# Altium schematic sheet PLL_ADF4169.SchDoc
size A3; SheetNumber: 13; SheetTotal: 25
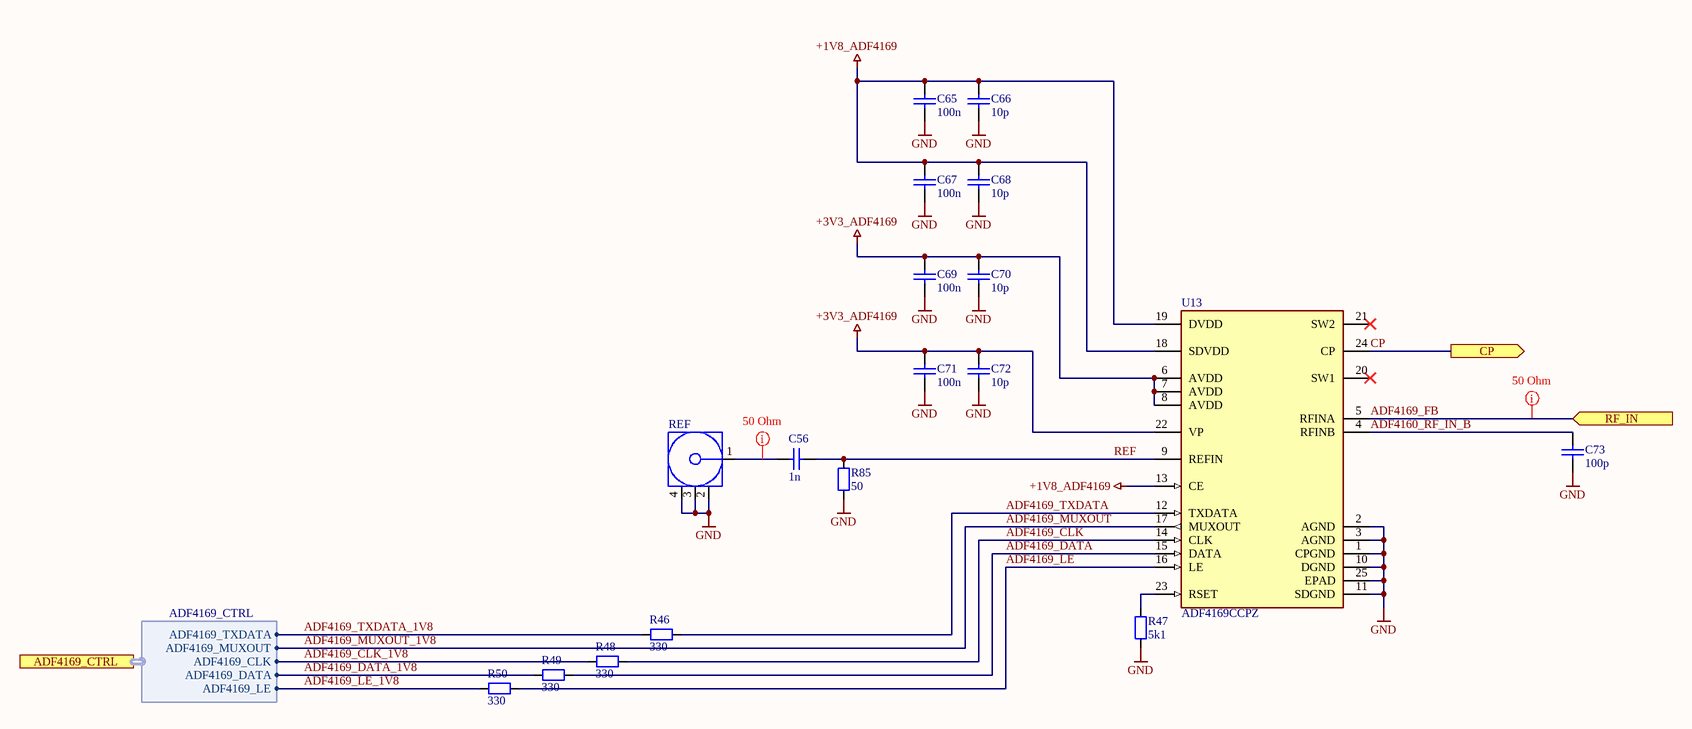
[diagram p0: PLL_ADF4169.SchDoc]

## Parts
C56  1n  [C_0402_1005Metric_IPC_N]
C65  100n  [C_0402_1005Metric_IPC_N]
C66  10p  [C_0402_1005Metric_IPC_N]
C67  100n  [C_0402_1005Metric_IPC_N]
C68  10p  [C_0402_1005Metric_IPC_N]
C69  100n  [C_0402_1005Metric_IPC_N]
C70  10p  [C_0402_1005Metric_IPC_N]
C71  100n  [C_0402_1005Metric_IPC_N]
C72  10p  [C_0402_1005Metric_IPC_N]
C73  100p  [C_0402_1005Metric_IPC_N]
R46  330  [R_0402_1005Metric_IPC_N]
R47  5k1  [R_0402_1005Metric_IPC_N]
R48  330  [R_0402_1005Metric_IPC_N]
R49  330  [R_0402_1005Metric_IPC_N]
R50  330  [R_0402_1005Metric_IPC_N]
R85  50  [R_0402_1005Metric_IPC_N]
REF  60312862112552  [60312862112552]  (value not drawn)
U13  ADF4169CCPZ  [LFCSP-WQ-24-1EP_4x4mm_P0.5mm_EP2.1x2.1mm_IPC_N]

## Ports
ADF4169_CTRL (harness ADF4169_CTRL, see Top_Level[2B], MCU[8A]), CP (out, see Top_Level[2B], Loop_Filter_AD8065[2C]), RF_IN (in, see Top_Level[2B])

## Harnesses
ADF4169_CTRL: ADF4169_MUXOUT, ADF4169_CLK, ADF4169_DATA, ADF4169_LE, ADF4169_TXDATA

## Nets
+1V8_ADF4169: C65.2 C66.2 C67.2 C68.2 U13.13(CE) U13.18(SDVDD) U13.19(DVDD)
+3V3_ADF4169: C69.2 C70.2 C71.2 C72.2 U13.6(AVDD) U13.7(AVDD) U13.8(AVDD) U13.22(VP)
GND: C65.1 C66.1 C67.1 C68.1 C69.1 C70.1 C71.1 C72.1 C73.1 R47.1 R85.1 REF.2(GND) REF.3(GND) REF.4(GND) U13.1(CPGND) U13.2(AGND) U13.3(AGND) U13.10(DGND) U13.11(SDGND) U13.25(EPAD)
ADF4160_RF_IN_B: C73.2 U13.4(RFINB)
ADF4169_CLK: R48.2 U13.14(CLK)
ADF4169_CLK_1V8: R48.1 ; port ADF4169_CTRL.ADF4169_CLK
ADF4169_DATA: R49.2 U13.15(DATA)
ADF4169_DATA_1V8: R49.1 ; port ADF4169_CTRL.ADF4169_DATA
ADF4169_FB: U13.5(RFINA) ; port RF_IN
ADF4169_LE: R50.2 U13.16(LE)
ADF4169_LE_1V8: R50.1 ; port ADF4169_CTRL.ADF4169_LE
ADF4169_MUXOUT: U13.17(MUXOUT) ; port ADF4169_CTRL.ADF4169_MUXOUT  [also labelled ADF4169_MUXOUT_1V8]
ADF4169_TXDATA: R46.2 U13.12(TXDATA)
ADF4169_TXDATA_1V8: R46.1 ; port ADF4169_CTRL.ADF4169_TXDATA
CP: U13.24(CP) ; port CP
REF: C56.1 R85.2 U13.9(REFIN)
NetC56_2: C56.2 REF.1(Signal)
NetR47_2: R47.2 U13.23(RSET)

Not connected (* = marked no-connect by the designer): U13 20(SW1)* 21(SW2)*

## Layout directives
net class 50R: ADF4169_FB
net class 50Ohm_CPWG: NetC56_2

## Library data of the parts
C56 = C000002: Generic MLCC with 0402 Footprint; Specific Component: False; Tolerance: 5%; Temp Coefficient: C0G; Voltage Rated: 50V; ID: C000002; Capacitance: 1n; min Temperature: *; max Temperature: *; Case: 0402; Supplier 1: Mouser; Supplier Part Number 1: 81-GRM1555C1H102JA1D; Supplier 2: Digikey; Supplier Part Number 2: 490-3244-1-ND
C65 C67 C69 C71 = C000002: Generic MLCC with 0402 Footprint; Specific Component: False; Tolerance: 10%; Temp Coefficient: X7R; Voltage Rated: 50V; ID: C000002; Capacitance: 100n; min Temperature: *; max Temperature: *; Case: 0402; Supplier 1: Mouser; Supplier Part Number 1: 81-GRM155R71H104KE4D; Supplier 2: Digikey; Supplier Part Number 2: 490-10700-1-ND
C66 C68 C70 C72 = C000002: Generic MLCC with 0402 Footprint; Specific Component: False; Tolerance: 0.5p; Temp Coefficient: C0G; Voltage Rated: 50V; ID: C000002; Capacitance: 10p; min Temperature: *; max Temperature: *; Case: 0402; Supplier 1: Mouser; Supplier Part Number 1: 187-CL05C100DB5NNNC; Supplier 2: Digikey; Supplier Part Number 2: 1276-1625-1-ND
C73 = C000002: Generic MLCC with 0402 Footprint; Specific Component: False; ID: C000002; Capacitance: 100p; Tolerance: *; Temp Coefficient: *; Voltage Rated: *; min Temperature: *; max Temperature: *; Case: 0402
R46 R48-R50 R85 = R000002: Generic Chip Resistor with 0402 Footprint; Specific Component: False; ID: R000002; Tolerance: *; Power Rating: *; Composition: *; min Temperature: *; max Temperature: *; Temp Coefficient: *; Case: 0402
  R46 R48-R50: Resistance: 330
  R85: Resistance: 50
R47 = R000002: Generic Chip Resistor with 0402 Footprint; Specific Component: False; Tolerance: 1%; ID: R000002; Resistance: 5k1; Power Rating: *; Composition: *; min Temperature: *; max Temperature: *; Temp Coefficient: *; Case: 0402
REF = X000012: WR-SMA Connector, PCB Solderless, DC~18GHz, 50Ohm; Manufacturer: Würth; Center Contact Diameter: 0.25mm; Connector Type: SMA; Gender: Jack; Interface Type: MIL-STD-348; Manufacturer Part Number: 60312862112552; Category: Coaxial Connectors; Match Code: WR-SMA; ComponentLink1Description: Datasheet; ComponentLink1URL: https://www.we-online.com/components/products/datasheet/60312862112552.pdf; ComponentLink2Description: Datasheet Link; ComponentLink2URL: https://www.we-online.com/redexpert/spec/60312862112552?ad; Mount: Screw; Operating Temperature Max: 165°C; Operating Temperature Min: -65°C; Packaging: Tray; Frequency Range: DC~18GHz; Impedance: 50Ohm; Orientation: Right Angle; ID: X000012; Type: SMA Solderless Würth; Part Value: 60312862112552
U13 = CLK000004: Manufacturer: Analog Devices; ID: CLK000004; Type: PLL; Manufacturer Part Number: ADF4169CCPZ; Part Value: ADF4169CCPZ; Case: 24-LFCSP-WQ (4x4); ComponentLink1Description: Datasheet; ComponentLink1URL: https://www.analog.com/media/en/technical-documentation/data-sheets/ADF4169.pdf; Supplier 1: Mouser; Supplier Part Number 1: 584-ADF4169CCPZ; Supplier 2: Digikey; Supplier Part Number 2: 505-ADF4169CCPZ-ND